# Altium project SML-230109PCB1.PrjPcb
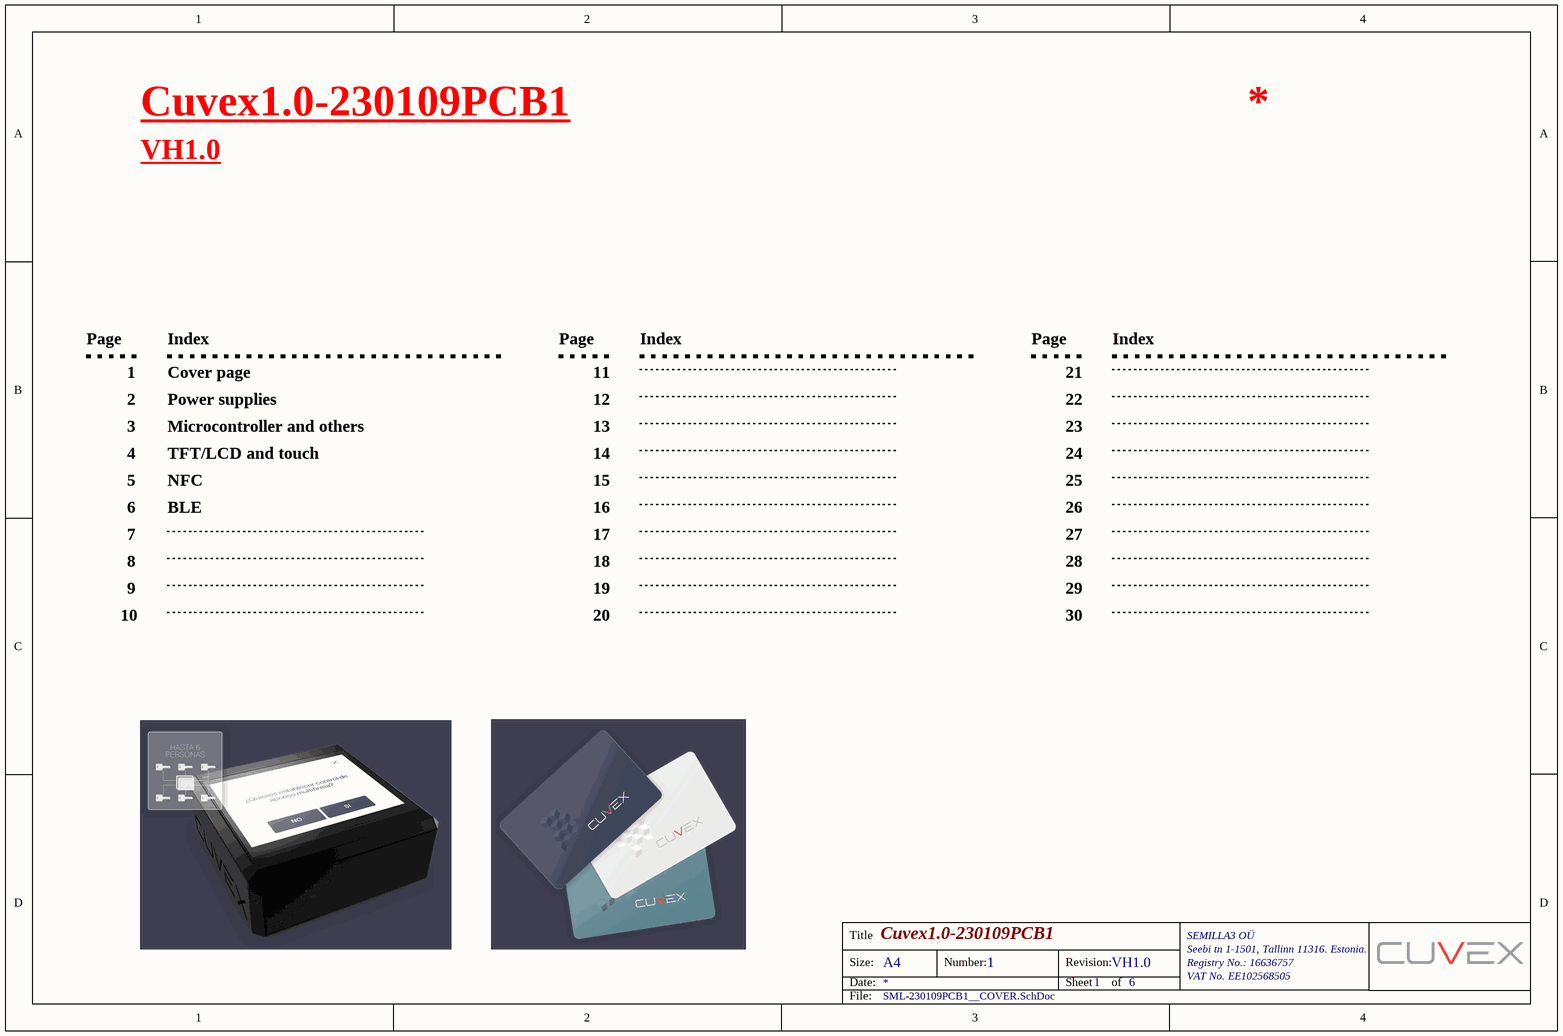
[diagram p0: SML-230109PCB1__COVER.SchDoc]
Revision: VH1.0; Title: Cuvex1.0-230109PCB1
6 sheets, 71 parts. Net scope: flat (ports and power ports of the same name join across sheets).
Board file: SML-230109PCB1.PcbDoc
Sheets:
  SML-230109PCB1__COVER.SchDoc
  SML-230109PCB1__PWR.SchDoc
  SML-230109PCB1__MCU.SchDoc
  SML-230109PCB1__LCD.SchDoc
  SML-230109PCB1__NFC.SchDoc
  SML-230109PCB1__BLE.SchDoc

## Sheet SML-230109PCB1__COVER.SchDoc: Cuvex1.0-230109PCB1
size A4; DocumentNumber: 1; SheetNumber: 1; SheetTotal: 6

### Notes on the sheet
- Page
- 1
- Index
- Cover page
- 11
- 21
- 2
- 3
- Power supplies
- Microcontroller and others
- 12
- 13
- 22
- 23
- 4
- 5
- 6
- TFT/LCD and touch
- NFC
- BLE
- 14
- 15
- 16
- 24
- 25
- 26
- 7
- 8
- 17
- 18
- 27
- 28
- 10
- 9
- 19
- 20
- 29
- 30
- Title
- Size:
- Date:
- A4
- Number:
- Revision:
- Sheet
- of
- SEMILLA3 OÜ
- Seebi tn 1-1501, Tallinn 11316. Estonia.
- Registry No.: 16636757
- VAT No. EE102568505
- File:

## Sheet SML-230109PCB1__PWR.SchDoc: Cuvex1.0-230109PCB1
size A4; DocumentNumber: 2; SheetNumber: 2; SheetTotal: 6
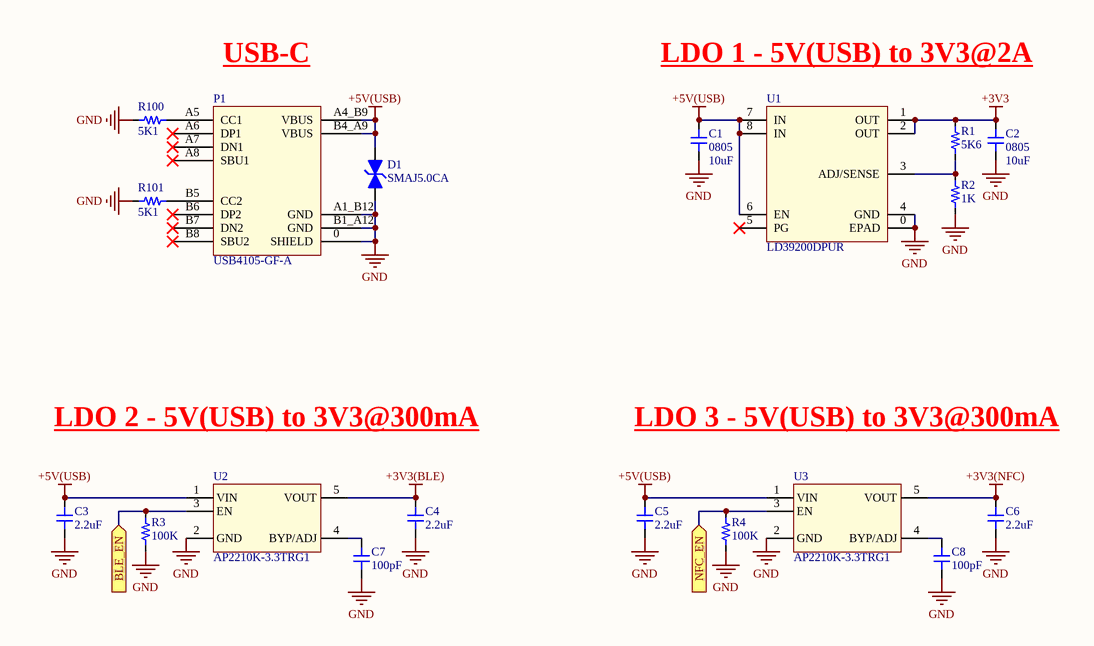
[diagram p1: SML-230109PCB1__PWR.SchDoc]

### Parts
C1  value 10uF  [06] - Package: 0805  [[G] CAP-MLCC__0805]  (hidden comment: .)
C2  value 10uF  [06] - Package: 0805  [[G] CAP-MLCC__0805]  (hidden comment: .)
C3  value 2.2uF  [[G] CAP-MLCC__0603]  (hidden comment: .)
C4  value 2.2uF  [[G] CAP-MLCC__0603]  (hidden comment: .)
C5  value 2.2uF  [[G] CAP-MLCC__0603]  (hidden comment: .)
C6  value 2.2uF  [[G] CAP-MLCC__0603]  (hidden comment: .)
C7  value 100pF  [[G] CAP-MLCC__0603]  (hidden comment: .)
C8  value 100pF  [[G] CAP-MLCC__0603]  (hidden comment: .)
D1  .  [[G] SMA(DO-214AC)__W/O]  (value not drawn)
P1  .  [CONN-USB-C__USB4105-GF-A]  (value not drawn)
R1  value 5K6  [[G] RES-CHIP__0603]  (hidden comment: .)
R2  value 1K  [[G] RES-CHIP__0603]  (hidden comment: .)
R3  value 100K  [[G] RES-CHIP__0603]  (hidden comment: .)
R4  value 100K  [[G] RES-CHIP__0603]  (hidden comment: .)
R100  value 5K1  [[G] RES-CHIP__0402]  (hidden comment: .)
R101  value 5K1  [[G] RES-CHIP__0402]  (hidden comment: .)
U1  .  [PMIC-LDO__LD39200DPUR__DFN-8(4X4)]  (value not drawn)
U2  .  [[G] SOT23-5]  (value not drawn)
U3  .  [[G] SOT23-5]  (value not drawn)

### Ports
BLE_EN (in, see 3[1A]), NFC_EN (in, see 3[1A])

### Nets
+3V3: C2.2 R1.2 U1.1(OUT) U1.2(OUT)
+3V3(BLE): C4.2 U2.5(VOUT)
+3V3(NFC): C6.2 U3.5(VOUT)
+5V(USB): C1.2 C3.2 C5.2 D1.K P1.A4_B9(VBUS) P1.B4_A9(VBUS) U1.6(EN) U1.7(IN) U1.8(IN) U2.1(VIN) U3.1(VIN)
GND: C1.1 C2.1 C3.1 C4.1 C5.1 C6.1 C7.1 C8.1 D1.A P1.0(SHIELD) P1.A1_B12(GND) P1.B1_A12(GND) R2.1 R3.1 R4.1 R100.1 R101.1 U1.0(EPAD) U1.4(GND) U2.2(GND) U3.2(GND)
BLE_EN: R3.2 U2.3(EN) ; port BLE_EN
NFC_EN: R4.2 U3.3(EN) ; port NFC_EN
NetC7_2: C7.2 U2.4(BYP/ADJ)
NetC8_2: C8.2 U3.4(BYP/ADJ)
NetP1_A5: P1.A5(CC1) R100.2
NetP1_B5: P1.B5(CC2) R101.2
NetR1_1: R1.1 R2.2 U1.3(ADJ/SENSE)

Not connected (* = marked no-connect by the designer): P1 A6(DP1)* A7(DN1)* A8(SBU1)* B6(DP2)* B7(DN2)* B8(SBU2)*; U1 5(PG)*

### Notes on the sheet
- (near P1) USB-C
- LDO 1 - 5V(USB) to 3V3@2A
- LDO 2 - 5V(USB) to 3V3@300mA
- LDO 3 - 5V(USB) to 3V3@300mA
- Title
- Size:
- Date:
- A4
- Number:
- Revision:
- Sheet
- of
- SEMILLA3 OÜ
- Seebi tn 1-1501, Tallinn 11316. Estonia.
- Registry No.: 16636757
- VAT No. EE102568505
- File:

### Library data of the parts
C1 C2 = CAP_MLCC_0805: CAP MLCC 0805; [00] - Description (BOM): CAP MLCC 10uF 0805 010; [04] - Power features: 010; STAR Code: C10uF0805010; [01] - MPN Code: *; [02] - Manufacturer: *; [03] - Datasheet: *; [05] - Temperature range: *; [07] - PVP Dealer name: *; [08] - PVP 1K: *; Voltage: 010
C3-C6 = CAP_MLCC_0603: CAP MLCC 0603; [00] - Description (BOM): CAP MLCC 2.2uF 0603 010; [04] - Power features: 010; STAR Code: C2.2uF0603010; [06] - Package: 0603; [01] - MPN Code: *; [02] - Manufacturer: *; [03] - Datasheet: *; [05] - Temperature range: *; [07] - PVP Dealer name: *; [08] - PVP 1K: *; Voltage: 010
C7 C8 = CAP_MLCC_0603: CAP MLCC 0603; [00] - Description (BOM): CAP MLCC 100pF 0603 010; [04] - Power features: 010; STAR Code: C100pF0603010; [06] - Package: 0603; [01] - MPN Code: *; [02] - Manufacturer: *; [03] - Datasheet: *; [05] - Temperature range: *; [07] - PVP Dealer name: *; [08] - PVP 1K: *; Voltage: 010
D1 = SMAJ5.0CA: DIODE TVS, SMA (DO-214AC), Vr=5V, Vbr=6'4V, Vc=9'2V, Ipp=43'5A, Pppm=400W; [02] - Manufacturer: Littelfuse; [05] - Temperature range: -65 to +150 ºC; [00] - Description (BOM): DIODE TVS, SMA (DO-214AC), Vr=5V, Vbr=6'4V, Vc=9'2V, Ipp=43'5A, Pppm=400W; [03] - Datasheet: https://www.littelfuse.com/media?resourcetype=datasheets&itemid=75e32973-b177-4ee3-a0ff-cedaf1abdb93&filename=smaj-datasheet; [04] - Power features: Vr=5V, Vbr=6'4V, Vc=9'2V, Ipp=43'5A; [06] - Package: SMA (DO-214AC); [07] - PVP Dealer name: *; [08] - PVP 1K: *; STAR Code: *; [01] - MPN Code: SMAJ5.0CA
P1 = USB4105-GF-A: CONN USB TYPE C, smd/th, right angle; [02] - Manufacturer: GCT; [04] - Power features: 20VDC, 5A (VBUS); [05] - Temperature range: -40 to +85 ºC; [00] - Description (BOM): CONN USB TYPE C, smd/th, right angle; [03] - Datasheet: https://www.mouser.es/datasheet/2/837/USB4105-2888174.pdf; [06] - Package: *; [07] - PVP Dealer name: *; [08] - PVP 1K: *; STAR Code: *; [01] - MPN Code: USB4105-GF-A
R1 = RES_SMD_0603: RES SMD 0603 [G]; [00] - Description (BOM): RES 5K6 OHM 0603 1% 1/10W; [04] - Power features: 100mW; STAR Code: 5K606031%; Tolerance: 1%; [06] - Package: 0603; [01] - MPN Code: *; [02] - Manufacturer: *; [03] - Datasheet: *; [05] - Temperature range: *; [07] - PVP Dealer name: *; [08] - PVP 1K: *
R2 = RES_SMD_0603: RES SMD 0603 [G]; [00] - Description (BOM): RES 1K OHM 0603 1% 1/10W; [04] - Power features: 100mW; STAR Code: 1K06031%; Tolerance: 1%; [06] - Package: 0603; [01] - MPN Code: *; [02] - Manufacturer: *; [03] - Datasheet: *; [05] - Temperature range: *; [07] - PVP Dealer name: *; [08] - PVP 1K: *
R3 R4 = RES_SMD_0603: RES SMD 0603 [G]; [00] - Description (BOM): RES 100K OHM 0603 1% 1/10W; [04] - Power features: 100mW; STAR Code: 100K06031%; Tolerance: 1%; [06] - Package: 0603; [01] - MPN Code: *; [02] - Manufacturer: *; [03] - Datasheet: *; [05] - Temperature range: *; [07] - PVP Dealer name: *; [08] - PVP 1K: *
R100 R101 = RES_SMD_0402: RES SMD 0402 [G]; [00] - Description (BOM): RES 5K1 OHM 0402 1% 1/16W; [04] - Power features: 62.5mW; STAR Code: 5K104021%; Tolerance: 1%; [06] - Package: 0402; [01] - MPN Code: *; [02] - Manufacturer: *; [03] - Datasheet: *; [05] - Temperature range: *; [07] - PVP Dealer name: *; [08] - PVP 1K: *
U1 = LD39200DPUR: PMIC LDO, DFN-8, Vout=ADJ, Iout=2000A, Vin=1'25-6'0V, Vdrop-max=130mV, Iq-max=1mA; [02] - Manufacturer: ST Microelectronics; [05] - Temperature range: -40 to +125 ºC; [06] - Package: DFN-8 (4x4mm); [00] - Description (BOM): PMIC LDO, DFN-8, Vout=ADJ, Iout=2000A, Vin=1'25-6'0V, Vdrop-max=130mV, Iq-max=1mA; [03] - Datasheet: https://www.mouser.es/datasheet/2/389/dm00102135-1798033.pdf; [04] - Power features: Vout=ADJ, Iout=2000A, Vin=1'25-6'0V, Vdrop-max=130mV, Iq-max=1mA; [07] - PVP Dealer name: *; [08] - PVP 1K: *; STAR Code: *; [01] - MPN Code: LD39200DPUR
U2 U3 = AP2210K-3.3TRG1: PMIC LDO, SOT23-5, Vout=3'3V, Iout=300mA, Vin=2'5-13'2V, Vdrop-max=250mV, Iq-max=4mA; [02] - Manufacturer: Diodes Incorporated; [05] - Temperature range: -40 to +125 ºC; [00] - Description (BOM): PMIC LDO, SOT23-5, Vout=3'3V, Iout=300mA, Vin=2'5-13'2V, Vdrop-max=250mV, Iq-max=4mA; [03] - Datasheet: https://www.diodes.com/assets/Datasheets/AP2210.pdf; [04] - Power features: Vout=3'3V, Iout=300mA, Vin=2'5-13'2V, Vdrop-max=250mV, Iq-max=4mA; [06] - Package: SOT23-5; [07] - PVP Dealer name: *; [08] - PVP 1K: *; STAR Code: *; [01] - MPN Code: AP2210K-3.3TRG1

## Sheet SML-230109PCB1__MCU.SchDoc: Cuvex1.0-230109PCB1
size A4; DocumentNumber: 3; SheetNumber: 3; SheetTotal: 6
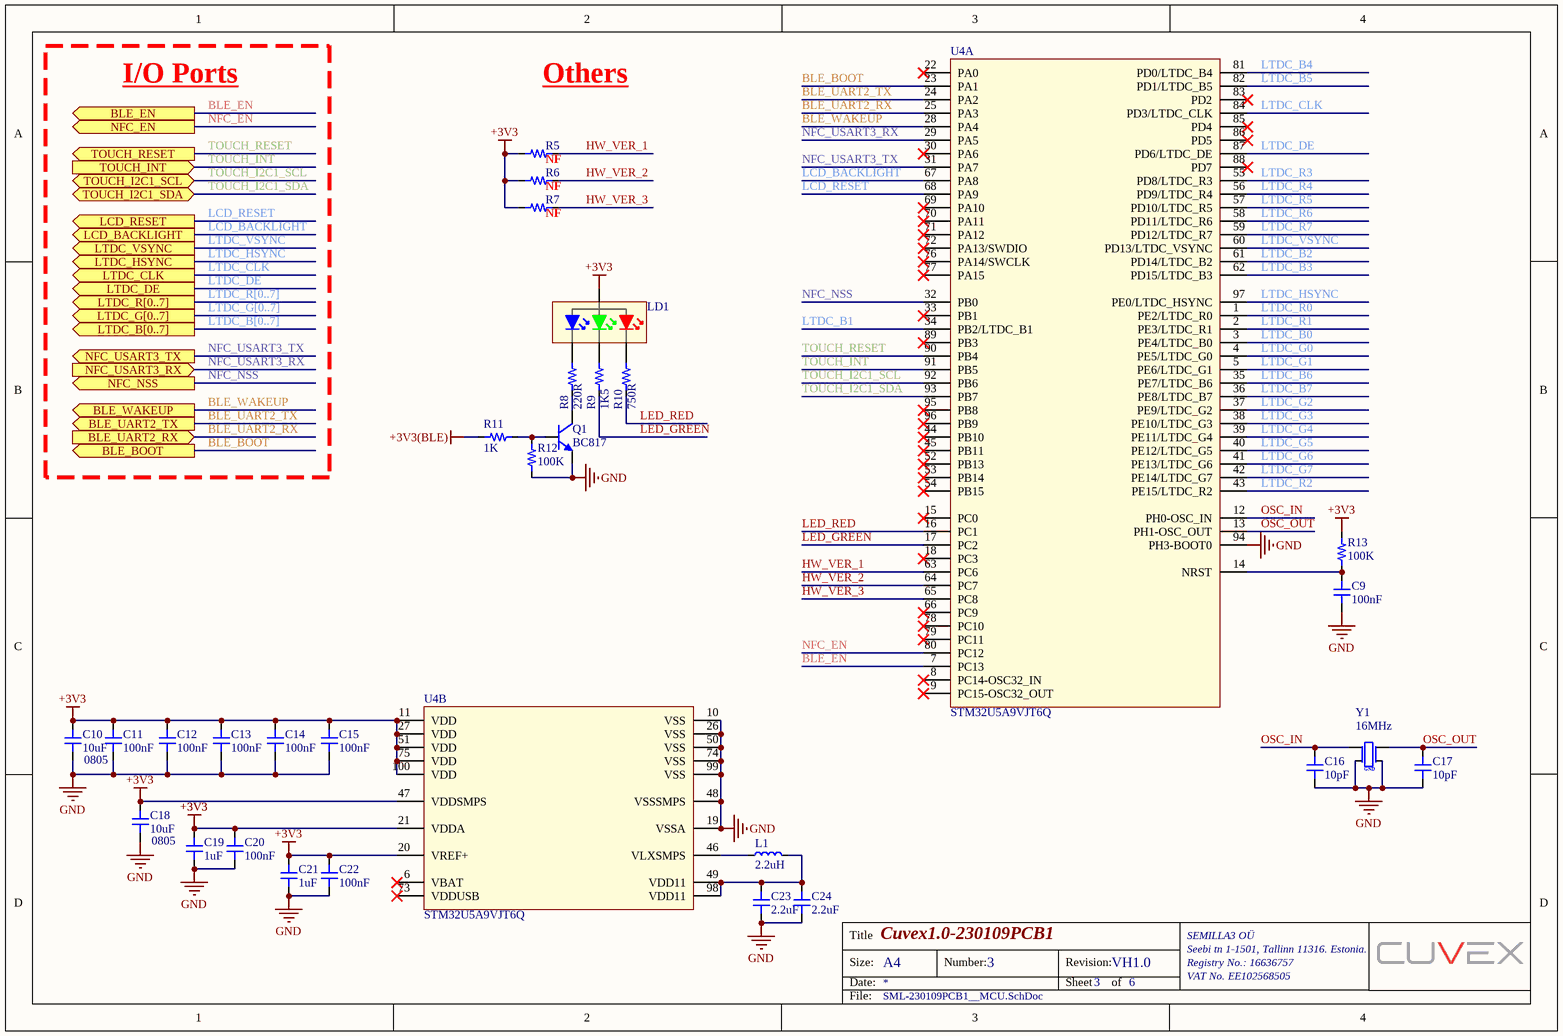
[diagram p2: SML-230109PCB1__MCU.SchDoc]

### Parts
C9  value 100nF  [[G] CAP-MLCC__0603]  (hidden comment: .)
C10  value 10uF  [06] - Package: 0805  [[G] CAP-MLCC__0805]  (hidden comment: .)
C11  value 100nF  [[G] CAP-MLCC__0603]  (hidden comment: .)
C12  value 100nF  [[G] CAP-MLCC__0603]  (hidden comment: .)
C13  value 100nF  [[G] CAP-MLCC__0603]  (hidden comment: .)
C14  value 100nF  [[G] CAP-MLCC__0603]  (hidden comment: .)
C15  value 100nF  [[G] CAP-MLCC__0603]  (hidden comment: .)
C16  value 10pF  [[G] CAP-MLCC__0603]  (hidden comment: .)
C17  value 10pF  [[G] CAP-MLCC__0603]  (hidden comment: .)
C18  value 10uF  [06] - Package: 0805  [[G] CAP-MLCC__0805]  (hidden comment: .)
C19  value 1uF  [[G] CAP-MLCC__0603]  (hidden comment: .)
C20  value 100nF  [[G] CAP-MLCC__0603]  (hidden comment: .)
C21  value 1uF  [[G] CAP-MLCC__0603]  (hidden comment: .)
C22  value 100nF  [[G] CAP-MLCC__0603]  (hidden comment: .)
C23  value 2.2uF  [[G] CAP-MLCC__0603]  (hidden comment: .)
C24  value 2.2uF  [[G] CAP-MLCC__0603]  (hidden comment: .)
L1  value 2.2uH  [[G] IND__0603]  (hidden comment: .)
LD1  .  [LED__0603-RGB__APHF1608]  (value not drawn)
Q1  .  [[G] SOT23-3]  (value not drawn)
R5  .  [[G] RES-CHIP__0603]  (value not drawn)
R6  .  [[G] RES-CHIP__0603]  (value not drawn)
R7  .  [[G] RES-CHIP__0603]  (value not drawn)
R8  value 220R  [[G] RES-CHIP__0603]  (hidden comment: .)
R9  value 1K5  [[G] RES-CHIP__0603]  (hidden comment: .)
R10  value 750R  [[G] RES-CHIP__0603]  (hidden comment: .)
R11  value 1K  [[G] RES-CHIP__0603]  (hidden comment: .)
R12  value 100K  [[G] RES-CHIP__0603]  (hidden comment: .)
R13  value 100K  [[G] RES-CHIP__0603]  (hidden comment: .)
U4  .  [[G] LQFP-100 (14X14MM)]  (value not drawn)  (parts A,B of 2)
Y1  value 16MHz  [CRYSTAL__ABM8G]  (hidden comment: .)

### Ports
BLE_BOOT (out, see 6[3C]), BLE_EN (out, see 2[1C]), BLE_UART2_RX (in, see 6[2A]), BLE_UART2_TX (out, see 6[2A]), BLE_WAKEUP (out, see 6[2A]), LCD_BACKLIGHT (out, see 4[3C]), LCD_RESET (out, see 4[1A]), LTDC_B[0..7] (out, see 4[1B]), LTDC_CLK (out, see 4[1C]), LTDC_DE (out, see 4[1D]), LTDC_G[0..7] (out, see 4[1B]), LTDC_HSYNC (out, see 4[1C]), LTDC_R[0..7] (out, see 4[1B]), LTDC_VSYNC (out, see 4[1C]), NFC_EN (out, see 2[3C]), NFC_NSS (out, see 5[2B]), NFC_USART3_RX (in, see 5[2B]), NFC_USART3_TX (out, see 5[2B]), TOUCH_I2C1_SCL (bidir, see 4[3A]), TOUCH_I2C1_SDA (bidir, see 4[3A]), TOUCH_INT (in, see 4[3B]), TOUCH_RESET (out, see 4[3A])

### Nets
+3V3: C10.2 C11.2 C12.2 C13.2 C14.2 C15.2 C18.2 C19.1 C20.1 C21.1 C22.1 LD1.A R5.1 R6.1 R7.1 R13.1 U4.11(VDD) U4.20(VREF+) U4.21(VDDA) U4.27(VDD) U4.47(VDDSMPS) U4.51(VDD) U4.75(VDD) U4.100(VDD)
+3V3(BLE): R11.2
GND: C9.2 C10.1 C11.1 C12.1 C13.1 C14.1 C15.1 C16.1 C17.1 C18.1 C19.2 C20.2 C21.2 C22.2 C23.1 C24.1 Q1.2(E) R12.1 U4.10(VSS) U4.19(VSSA) U4.26(VSS) U4.48(VSSSMPS) U4.50(VSS) U4.74(VSS) U4.94(PH3-BOOT0) U4.99(VSS) Y1.2(gnd) Y1.4(gnd)
BLE_BOOT: U4.23(PA1) ; port BLE_BOOT
BLE_EN: U4.7(PC13) ; port BLE_EN
BLE_UART2_RX: U4.25(PA3) ; port BLE_UART2_RX
BLE_UART2_TX: U4.24(PA2) ; port BLE_UART2_TX
BLE_WAKEUP: U4.28(PA4) ; port BLE_WAKEUP
HW_VER_1: R5.2 U4.63(PC6)
HW_VER_2: R6.2 U4.64(PC7)
HW_VER_3: R7.2 U4.65(PC8)
LCD_BACKLIGHT: U4.67(PA8) ; port LCD_BACKLIGHT
LCD_RESET: U4.68(PA9) ; port LCD_RESET
LED_GREEN: R9.2 U4.17(PC2)
LED_RED: R10.2 U4.16(PC1)
LTDC_B0: U4.3(PE4/LTDC_B0)
LTDC_B1: U4.34(PB2/LTDC_B1)
LTDC_B2: U4.61(PD14/LTDC_B2)
LTDC_B3: U4.62(PD15/LTDC_B3)
LTDC_B4: U4.81(PD0/LTDC_B4)
LTDC_B5: U4.82(PD1/LTDC_B5)
LTDC_B6: U4.35(PE7/LTDC_B6)
LTDC_B7: U4.36(PE8/LTDC_B7)
LTDC_CLK: U4.84(PD3/LTDC_CLK) ; port LTDC_CLK
LTDC_DE: U4.87(PD6/LTDC_DE) ; port LTDC_DE
LTDC_G0: U4.4(PE5/LTDC_G0)
LTDC_G1: U4.5(PE6/LTDC_G1)
LTDC_G2: U4.37(PE9/LTDC_G2)
LTDC_G3: U4.38(PE10/LTDC_G3)
LTDC_G4: U4.39(PE11/LTDC_G4)
LTDC_G5: U4.40(PE12/LTDC_G5)
LTDC_G6: U4.41(PE13/LTDC_G6)
LTDC_G7: U4.42(PE14/LTDC_G7)
LTDC_HSYNC: U4.97(PE0/LTDC_HSYNC) ; port LTDC_HSYNC
LTDC_R0: U4.1(PE2/LTDC_R0)
LTDC_R1: U4.2(PE3/LTDC_R1)
LTDC_R2: U4.43(PE15/LTDC_R2)
LTDC_R3: U4.55(PD8/LTDC_R3)
LTDC_R4: U4.56(PD9/LTDC_R4)
LTDC_R5: U4.57(PD10/LTDC_R5)
LTDC_R6: U4.58(PD11/LTDC_R6)
LTDC_R7: U4.59(PD12/LTDC_R7)
LTDC_VSYNC: U4.60(PD13/LTDC_VSYNC) ; port LTDC_VSYNC
NFC_EN: U4.80(PC12) ; port NFC_EN
NFC_NSS: U4.32(PB0) ; port NFC_NSS
NFC_USART3_RX: U4.29(PA5) ; port NFC_USART3_RX
NFC_USART3_TX: U4.31(PA7) ; port NFC_USART3_TX
OSC_IN: C16.2 U4.12(PH0-OSC_IN) Y1.1(OSC1)
OSC_OUT: C17.2 U4.13(PH1-OSC_OUT) Y1.3(OSC2)
TOUCH_I2C1_SCL: U4.92(PB6) ; port TOUCH_I2C1_SCL
TOUCH_I2C1_SDA: U4.93(PB7) ; port TOUCH_I2C1_SDA
TOUCH_INT: U4.91(PB5) ; port TOUCH_INT
TOUCH_RESET: U4.90(PB4) ; port TOUCH_RESET
NetC9_1: C9.1 R13.2 U4.14(NRST)
NetC23_2: C23.2 C24.2 L1.2 U4.49(VDD11) U4.98(VDD11)
NetL1_1: L1.1 U4.46(VLXSMPS)
NetLD1_KB: LD1.KB R8.2
NetLD1_KG: LD1.KG R9.1
NetLD1_KR: LD1.KR R10.1
NetQ1_1: Q1.1(B) R11.1 R12.2
NetQ1_3: Q1.3(C) R8.1

Not connected (* = marked no-connect by the designer): U4 6(VBAT)* 8(PC14-OSC32_IN)* 9(PC15-OSC32_OUT)* 15(PC0)* 18(PC3)* 22(PA0)* 30(PA6)* 33(PB1)* 44(PB10)* 45(PB11)* 52(PB13)* 53(PB14)* 54(PB15)* 66(PC9)* 69(PA10)* 70(PA11)* 71(PA12)* 72(PA13/SWDIO)* 73(VDDUSB)* 76(PA14/SWCLK)* 77(PA15)* 78(PC10)* 79(PC11)* 83(PD2)* 85(PD4)* 86(PD5)* 88(PD7)* 89(PB3)* 95(PB8)* 96(PB9)*

### Buses and harness runs
bus LTDC_B[0..7] = port LTDC_B[0..7]
bus LTDC_G[0..7] = port LTDC_G[0..7]
bus LTDC_R[0..7] = port LTDC_R[0..7]

### Notes on the sheet
- I/O Ports
- Others
- (near R5) NF
- (near R6) NF
- (near R7) NF
- Title
- Size:
- Date:
- A4
- Number:
- Revision:
- Sheet
- of
- SEMILLA3 OÜ
- Seebi tn 1-1501, Tallinn 11316. Estonia.
- Registry No.: 16636757
- VAT No. EE102568505
- File:
- (in symbol ABM8G-16.000MHZ-4Y-T3) GND

### Library data of the parts
C9 C11-C15 C20 C22 = CAP_MLCC_0603: CAP MLCC 0603; [00] - Description (BOM): CAP MLCC 100nF 0603 010; [04] - Power features: 010; STAR Code: C100nF0603010; [06] - Package: 0603; [01] - MPN Code: *; [02] - Manufacturer: *; [03] - Datasheet: *; [05] - Temperature range: *; [07] - PVP Dealer name: *; [08] - PVP 1K: *; Voltage: 010
C10 C18 = CAP_MLCC_0805: as C1 on sheet SML-230109PCB1__PWR; [01] - MPN Code: *; [02] - Manufacturer: *; [03] - Datasheet: *; [05] - Temperature range: *; [07] - PVP Dealer name: *; [08] - PVP 1K: *; Voltage: 010
C16 C17 = CAP_MLCC_0603: CAP MLCC 0603; [00] - Description (BOM): CAP MLCC 10pF 0603 010; [04] - Power features: 010; STAR Code: C10pF0603010; [06] - Package: 0603; [01] - MPN Code: *; [02] - Manufacturer: *; [03] - Datasheet: *; [05] - Temperature range: *; [07] - PVP Dealer name: *; [08] - PVP 1K: *; Voltage: 010
C19 C21 = CAP_MLCC_0603: CAP MLCC 0603; [00] - Description (BOM): CAP MLCC 1uF 0603 010; [04] - Power features: 010; STAR Code: C1uF0603010; [06] - Package: 0603; [01] - MPN Code: *; [02] - Manufacturer: *; [03] - Datasheet: *; [05] - Temperature range: *; [07] - PVP Dealer name: *; [08] - PVP 1K: *; Voltage: 010
C23 C24 = CAP_MLCC_0603: as C3 on sheet SML-230109PCB1__PWR; [01] - MPN Code: *; [02] - Manufacturer: *; [03] - Datasheet: *; [05] - Temperature range: *; [07] - PVP Dealer name: *; [08] - PVP 1K: *; Voltage: 010
L1 = IND_SMD_0603: IND SMD 0603 [G]; [01] - MPN Code: LQM18FN2R2M00D; [00] - Description (BOM): IND 2.2uH 0603; [06] - Package: 0603; [02] - Manufacturer: *; [03] - Datasheet: *; [04] - Power features: *; [05] - Temperature range: *; [07] - PVP Dealer name: *; [08] - PVP 1K: *; STAR Code: *
LD1 = APHF1608LSEEQBDZGKC: LED 0603, RGB (621/525/465nm), If=2mA, Vf=1'8-2'65V; [02] - Manufacturer: Kingbright; [05] - Temperature range: -40 to+85 ºC; [06] - Package: 0603; [00] - Description (BOM): LED 0603, RGB (621/525/465nm), If=2mA, Vf=1'8-2'65V; [03] - Datasheet: https://www.mouser.es/datasheet/2/216/APHF1608LSEEQBDZGKC-1145215.pdf; [04] - Power features: If=2mA, Vf=1'8-2'65V; [07] - PVP Dealer name: *; [08] - PVP 1K: *; STAR Code: *; [01] - MPN Code: APHF1608LSEEQBDZGKC
Q1 = BC817: TRANS BIPOLAR NPN, SOT23-3 [G]; [00] - Description (BOM): TRANS BIPOLAR NPN, SOT23-3 [G]; [02] - Manufacturer: *; [03] - Datasheet: *; [04] - Power features: *; [05] - Temperature range: *; [06] - Package: SOT23-3; [07] - PVP Dealer name: *; [08] - PVP 1K: *; [01] - MPN Code: *; STAR Code: BC817
R5-R7 = RES_SMD_0603: RES SMD 0603 [G]; [00] - Description (BOM): RES * OHM 0603 1% 1/10W; [04] - Power features: 100mW; STAR Code: *06031%; Tolerance: 1%; [06] - Package: 0603; [01] - MPN Code: *; [02] - Manufacturer: *; [03] - Datasheet: *; [05] - Temperature range: *; [07] - PVP Dealer name: *; [08] - PVP 1K: *; Value: *
R8 = RES_SMD_0603: RES SMD 0603 [G]; [00] - Description (BOM): RES 220R OHM 0603 1% 1/10W; [04] - Power features: 100mW; STAR Code: 220R06031%; Tolerance: 1%; [06] - Package: 0603; [01] - MPN Code: *; [02] - Manufacturer: *; [03] - Datasheet: *; [05] - Temperature range: *; [07] - PVP Dealer name: *; [08] - PVP 1K: *
R9 = RES_SMD_0603: RES SMD 0603 [G]; [00] - Description (BOM): RES 1K5 OHM 0603 1% 1/10W; [04] - Power features: 100mW; STAR Code: 1K506031%; Tolerance: 1%; [06] - Package: 0603; [01] - MPN Code: *; [02] - Manufacturer: *; [03] - Datasheet: *; [05] - Temperature range: *; [07] - PVP Dealer name: *; [08] - PVP 1K: *
R10 = RES_SMD_0603: RES SMD 0603 [G]; [00] - Description (BOM): RES 750R OHM 0603 1% 1/10W; [04] - Power features: 100mW; STAR Code: 750R06031%; Tolerance: 1%; [06] - Package: 0603; [01] - MPN Code: *; [02] - Manufacturer: *; [03] - Datasheet: *; [05] - Temperature range: *; [07] - PVP Dealer name: *; [08] - PVP 1K: *
R11 = RES_SMD_0603: as R2 on sheet SML-230109PCB1__PWR; [01] - MPN Code: *; [02] - Manufacturer: *; [03] - Datasheet: *; [05] - Temperature range: *; [07] - PVP Dealer name: *; [08] - PVP 1K: *
R12 R13 = RES_SMD_0603: as R3 on sheet SML-230109PCB1__PWR; [01] - MPN Code: *; [02] - Manufacturer: *; [03] - Datasheet: *; [05] - Temperature range: *; [07] - PVP Dealer name: *; [08] - PVP 1K: *
U4 = STM32U5A9VJT6Q: MCU ARM 32bit, Cortex-M33 (160MHz), 4MB/2'5MB, LQFP-100 (14x14), SMPS, TrustZone, LTDC, crypto; [02] - Manufacturer: STMicroelectronics; [04] - Power features: Vin=1'71-3'6V; [05] - Temperature range: -40 to +85 ºC; [00] - Description (BOM): MCU ARM 32bit, Cortex-M33 (160MHz), 4MB/2'5MB, LQFP-100 (14x14), SMPS, TrustZone, LTDC, crypto; [03] - Datasheet: https://www.st.com/resource/en/datasheet/stm32u5a9vj.pdf; [06] - Package: LQFP-100 (14x14); [07] - PVP Dealer name: *; [08] - PVP 1K: *; STAR Code: *; [01] - MPN Code: STM32U5A9VJT6Q
Y1 = ABM8G-16.000MHZ-4Y-T3: CRYSTAL, 16.0000MHz, ±30ppm, CL=10pF, CS=5pF; [02] - Manufacturer: Abracon LLC; [05] - Temperature range: -10 to +60 ºC; [06] - Package: ABM8G (3.2 x 2.5mm); [00] - Description (BOM): CRYSTAL, 16.0000MHz, ±30ppm, CL=10pF, CS=5pF; [03] - Datasheet: https://www.mouser.es/datasheet/2/3/ABM8G-1608872.pdf; [04] - Power features: *; [07] - PVP Dealer name: *; [08] - PVP 1K: *; STAR Code: *; [01] - MPN Code: ABM8G-16.000MHZ-4Y-T3

## Sheet SML-230109PCB1__LCD.SchDoc: Cuvex1.0-230109PCB1
size A4; DocumentNumber: 4; SheetNumber: 4; SheetTotal: 6
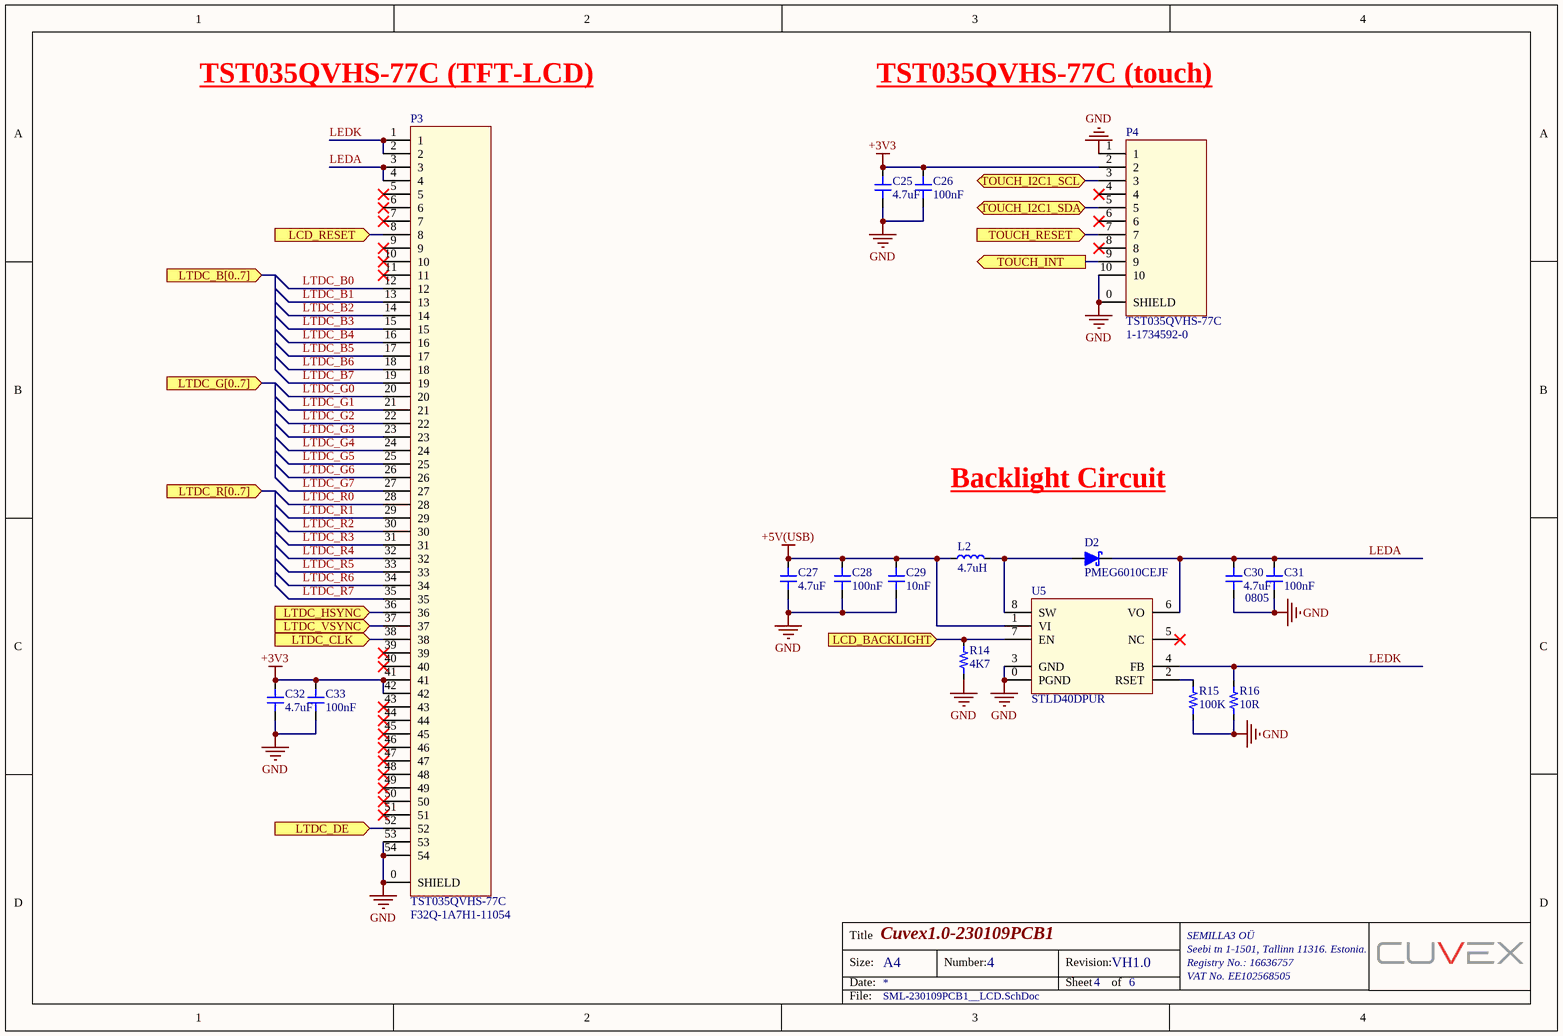
[diagram p3: SML-230109PCB1__LCD.SchDoc]

### Parts
C25  value 4.7uF  [[G] CAP-MLCC__0603]  (hidden comment: .)
C26  value 100nF  [[G] CAP-MLCC__0603]  (hidden comment: .)
C27  value 4.7uF  [[G] CAP-MLCC__0603]  (hidden comment: .)
C28  value 100nF  [[G] CAP-MLCC__0603]  (hidden comment: .)
C29  value 10nF  [[G] CAP-MLCC__0603]  (hidden comment: .)
C30  value 4.7uF  [06] - Package: 0805  [[G] CAP-MLCC__0805]  (hidden comment: .)
C31  value 100nF  [[G] CAP-MLCC__0603]  (hidden comment: .)
C32  value 4.7uF  [[G] CAP-MLCC__0603]  (hidden comment: .)
C33  value 100nF  [[G] CAP-MLCC__0603]  (hidden comment: .)
D2  .  [[G] SOD-323__W]  (value not drawn)
L2  value 4.7uH  [IND__LQH32PH__3'2x2'5x1'55mm]  (hidden comment: .)
P3  TFT-LCD: TST035QVHS-77C  [CONN-FFC/FPC__AMPHENOL__54P-TOP__F32Q-1A7H1-11054__INV]  (hidden comment: .)
P4  TFT-LCD: TST035QVHS-77C  [CONN-FFC/FPC__TE__10P-BOT__1-1734592-0__INV]  (hidden comment: .)
R14  value 4K7  [[G] RES-CHIP__0603]  (hidden comment: .)
R15  value 100K  [[G] RES-CHIP__0603]  (hidden comment: .)
R16  value 10R  [[G] RES-CHIP__0603]  (hidden comment: .)
U5  .  [IC-DRV-LED__STLD40DPUR__QFN-8(3X3)]  (value not drawn)

### Ports
LCD_BACKLIGHT (in, see 3[1A]), LCD_RESET (in, see 3[1A]), LTDC_B[0..7] (in, see 3[1B]), LTDC_CLK (in, see 3[1B]), LTDC_DE (in, see 3[1B]), LTDC_G[0..7] (in, see 3[1B]), LTDC_HSYNC (in, see 3[1B]), LTDC_R[0..7] (in, see 3[1B]), LTDC_VSYNC (in, see 3[1A]), TOUCH_I2C1_SCL (bidir, see 3[1A]), TOUCH_I2C1_SDA (bidir, see 3[1A]), TOUCH_INT (out, see 3[1A]), TOUCH_RESET (in, see 3[1A])

### Nets
+3V3: C25.2 C26.2 C32.2 C33.2 P3.41 P3.42 P4.2
+5V(USB): C27.2 C28.2 C29.2 L2.1 U5.1(VI)
GND: C25.1 C26.1 C27.1 C28.1 C29.1 C30.1 C31.1 C32.1 C33.1 P3.0(SHIELD) P3.53 P3.54 P4.0(SHIELD) P4.1 P4.10 R14.2 R15.1 R16.1 U5.0(PGND) U5.3(GND)
LCD_BACKLIGHT: R14.1 U5.7(EN) ; port LCD_BACKLIGHT
LCD_RESET: P3.8 ; port LCD_RESET
LEDA: C30.2 C31.2 D2.K P3.3 P3.4 U5.6(VO)
LEDK: P3.1 P3.2 R16.2 U5.4(FB)
LTDC_B0: P3.12
LTDC_B1: P3.13
LTDC_B2: P3.14
LTDC_B3: P3.15
LTDC_B4: P3.16
LTDC_B5: P3.17
LTDC_B6: P3.18
LTDC_B7: P3.19
LTDC_CLK: P3.38 ; port LTDC_CLK
LTDC_DE: P3.52 ; port LTDC_DE
LTDC_G0: P3.20
LTDC_G1: P3.21
LTDC_G2: P3.22
LTDC_G3: P3.23
LTDC_G4: P3.24
LTDC_G5: P3.25
LTDC_G6: P3.26
LTDC_G7: P3.27
LTDC_HSYNC: P3.36 ; port LTDC_HSYNC
LTDC_R0: P3.28
LTDC_R1: P3.29
LTDC_R2: P3.30
LTDC_R3: P3.31
LTDC_R4: P3.32
LTDC_R5: P3.33
LTDC_R6: P3.34
LTDC_R7: P3.35
LTDC_VSYNC: P3.37 ; port LTDC_VSYNC
TOUCH_I2C1_SCL: P4.3 ; port TOUCH_I2C1_SCL
TOUCH_I2C1_SDA: P4.5 ; port TOUCH_I2C1_SDA
TOUCH_INT: P4.9 ; port TOUCH_INT
TOUCH_RESET: P4.7 ; port TOUCH_RESET
NetD2_A: D2.A L2.2 U5.8(SW)
NetR15_2: R15.2 U5.2(RSET)

Not connected (* = marked no-connect by the designer): P3 5* 6* 7* 9* 10* 11* 39* 40* 43* 44* 45* 46* 47* 48* 49* 50* 51*; P4 4* 6* 8*; U5 5(NC)*

### Notes on the sheet
- (near P3) TST035QVHS-77C (TFT-LCD)
- TST035QVHS-77C (touch)
- Backlight Circuit
- Title
- Size:
- Date:
- A4
- Number:
- Revision:
- Sheet
- of
- SEMILLA3 OÜ
- Seebi tn 1-1501, Tallinn 11316. Estonia.
- Registry No.: 16636757
- VAT No. EE102568505
- File:

### Library data of the parts
C25 C27 C32 = CAP_MLCC_0603: CAP MLCC 0603; [00] - Description (BOM): CAP MLCC 4.7uF 0603 010; [04] - Power features: 010; STAR Code: C4.7uF0603010; [06] - Package: 0603; [01] - MPN Code: *; [02] - Manufacturer: *; [03] - Datasheet: *; [05] - Temperature range: *; [07] - PVP Dealer name: *; [08] - PVP 1K: *; Voltage: 010
C26 C28 C33 = CAP_MLCC_0603: as C9 on sheet SML-230109PCB1__MCU; [01] - MPN Code: *; [02] - Manufacturer: *; [03] - Datasheet: *; [05] - Temperature range: *; [07] - PVP Dealer name: *; [08] - PVP 1K: *; Voltage: 010
C29 = CAP_MLCC_0603: CAP MLCC 0603; [00] - Description (BOM): CAP MLCC 10nF 0603 010; [04] - Power features: 010; STAR Code: C10nF0603010; [06] - Package: 0603; [01] - MPN Code: *; [02] - Manufacturer: *; [03] - Datasheet: *; [05] - Temperature range: *; [07] - PVP Dealer name: *; [08] - PVP 1K: *; Voltage: 010
C30 = CAP_MLCC_0805: CAP MLCC 0805; [00] - Description (BOM): CAP MLCC 4.7uF 0805 050; [04] - Power features: 050; STAR Code: C4.7uF0805050; [01] - MPN Code: *; [02] - Manufacturer: *; [03] - Datasheet: *; [05] - Temperature range: *; [07] - PVP Dealer name: *; [08] - PVP 1K: *; Voltage: 050
C31 = CAP_MLCC_0603: CAP MLCC 0603; [00] - Description (BOM): CAP MLCC 100nF 0603 050; [04] - Power features: 050; STAR Code: C100nF0603050; [06] - Package: 0603; [01] - MPN Code: *; [02] - Manufacturer: *; [03] - Datasheet: *; [05] - Temperature range: *; [07] - PVP Dealer name: *; [08] - PVP 1K: *; Voltage: 050
D2 = PMEG6010CEJF: DIODE SCHOTTKY & RECTIFIER, SOD-323F, Vf=570mV, If=1A, Vr=60V, Ir=50uA; [02] - Manufacturer: Nexperia; [05] - Temperature range: -65 to +150 ºC; [00] - Description (BOM): DIODE SCHOTTKY & RECTIFIER, SOD-323F, Vf=570mV, If=1A, Vr=60V, Ir=50uA; [03] - Datasheet: https://www.mouser.es/datasheet/2/916/PMEG6010CEH_PMEG6010CEJ-1319617.pdf; [04] - Power features: Vf=570mV, If=1A, Vr=60V, Ir=50uA; [06] - Package: SOD-323F; [07] - PVP Dealer name: *; [08] - PVP 1K: *; STAR Code: *; [01] - MPN Code: PMEG6010CEJF
L2 = LQH32PH4R7NN0L: IND Murata, LQH32PHxxx, 4'7uH; [04] - Power features: Iccmáx=1A, Rccmáx=180mohm, 30%; [05] - Temperature range: -40 to +125 ºC; [06] - Package: LQH32PHxxx (3.2x2.5mm); [00] - Description (BOM): IND Murata, LQH32PHxxx, 4'7uH; [02] - Manufacturer: Murata; [03] - Datasheet: https://www.mouser.mx/datasheet/2/281/1/JELF243A_9136-1699509.pdf; [07] - PVP Dealer name: *; [08] - PVP 1K: *; STAR Code: *; [01] - MPN Code: LQH32PH4R7NN0L
P3 = F32Q-1A7H1-11054: CONN FFC/FPC, AMPHENOL, right angle, 54pin (0'5mm), top contact; [04] - Power features: V=50Vac/dc, I=±500mA; [05] - Temperature range: -40 to +105 ºC; [06] - Package: 34'3 x 5'5 x 2 mm; [00] - Description (BOM): CONN FFC/FPC, AMPHENOL, right angle, 54pin (0'5mm), top contact; [02] - Manufacturer: Amphenol; [03] - Datasheet: https://cdn.amphenol-cs.com/media/wysiwyg/files/documentation/datasheet/flex/ffc_fpc_050mm_f32r_f32q.pdf; [07] - PVP Dealer name: *; [08] - PVP 1K: *; STAR Code: *; [01] - MPN Code: F32Q-1A7H1-11054
P4 = 1-1734592-0: CONN FFC/FPC, TE, right angle, 10pin (0'5mm), bot contact; [02] - Manufacturer: TE Connectivity; [04] - Power features: V=250Vac/dc, I=500mA; [05] - Temperature range: -40 to +85 ºC; [06] - Package: 10'43 x 5'1 x 2 mm; [00] - Description (BOM): CONN FFC/FPC, TE, right angle, 10pin (0'5mm), bot contact; [03] - Datasheet: https://www.te.com/commerce/DocumentDelivery/DDEController?Action=showdoc&DocId=Customer+Drawing%7F1734839%7FC%7Fpdf%7FEnglish%7FENG_CD_1734839_C_C_1734839.pdf%7F1-1734839-0; [07] - PVP Dealer name: *; [08] - PVP 1K: *; STAR Code: *; [01] - MPN Code: 1-1734592-0
R14 = RES_SMD_0603: RES SMD 0603 [G]; [00] - Description (BOM): RES 4K7 OHM 0603 1% 1/10W; [04] - Power features: 100mW; STAR Code: 4K706031%; Tolerance: 1%; [06] - Package: 0603; [01] - MPN Code: *; [02] - Manufacturer: *; [03] - Datasheet: *; [05] - Temperature range: *; [07] - PVP Dealer name: *; [08] - PVP 1K: *
R15 = RES_SMD_0603: as R3 on sheet SML-230109PCB1__PWR; [01] - MPN Code: *; [02] - Manufacturer: *; [03] - Datasheet: *; [05] - Temperature range: *; [07] - PVP Dealer name: *; [08] - PVP 1K: *
R16 = RES_SMD_0603: RES SMD 0603 [G]; [00] - Description (BOM): RES 10R OHM 0603 1% 1/10W; [04] - Power features: 100mW; STAR Code: 10R06031%; Tolerance: 1%; [06] - Package: 0603; [01] - MPN Code: *; [02] - Manufacturer: *; [03] - Datasheet: *; [05] - Temperature range: *; [07] - PVP Dealer name: *; [08] - PVP 1K: *
U5 = STLD40DPUR: IC DRV LED BOOST, 1 output, Vdd=3'00-5'5V, Vout≤37V, Iout=20mA; [02] - Manufacturer: ST Microelectronics; [05] - Temperature range: -40 to +85 ºC; [06] - Package: QFN-8(3x3); [00] - Description (BOM): IC DRV LED BOOST, 1 output, Vdd=3'00-5'5V, Vout≤37V, Iout=20mA; [03] - Datasheet: https://www.mouser.es/datasheet/2/389/stld40d-1850966.pdf; [04] - Power features: Vdd=3'00-5'5V, Vout≤37V, Iout=20mA; [07] - PVP Dealer name: *; [08] - PVP 1K: *; STAR Code: *; [01] - MPN Code: STLD40DPUR

## Sheet SML-230109PCB1__NFC.SchDoc: Cuvex1.0-230109PCB1
size A4; DocumentNumber: 5; SheetNumber: 5; SheetTotal: 6
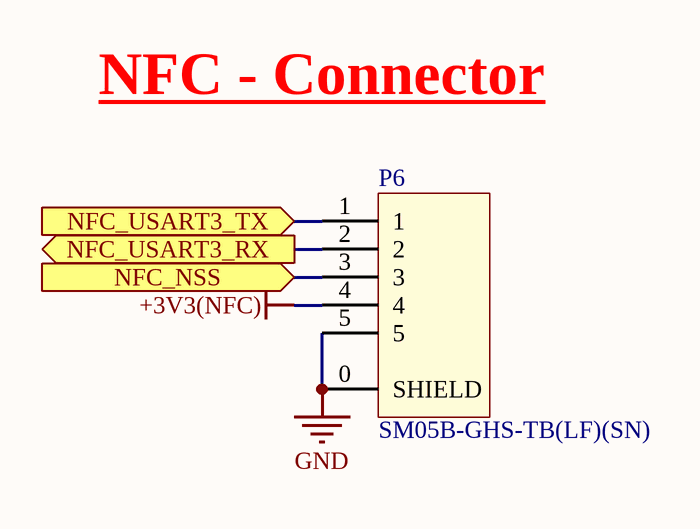
[diagram p4: SML-230109PCB1__NFC.SchDoc]

### Parts
P6  .  [CONN-SMD__JST(5PIN)__SM05B-GHS-TB(LF)(SN)]  (value not drawn)

### Ports
NFC_NSS (in, see 3[1B]), NFC_USART3_RX (out, see 3[1B]), NFC_USART3_TX (in, see 3[1B])

### Nets
+3V3(NFC): P6.4
GND: P6.0(SHIELD) P6.5
NFC_NSS: P6.3 ; port NFC_NSS
NFC_USART3_RX: P6.2 ; port NFC_USART3_RX
NFC_USART3_TX: P6.1 ; port NFC_USART3_TX

### Notes on the sheet
- NFC - Connector
- Title
- Size:
- Date:
- A4
- Number:
- Revision:
- Sheet
- of
- SEMILLA3 OÜ
- Seebi tn 1-1501, Tallinn 11316. Estonia.
- Registry No.: 16636757
- VAT No. EE102568505
- File:

### Library data of the parts
P6 = SM05B-GHS-TB(LF)(SN): CONN SMD, JST, side entry, 1x5pin, with lock, 1A, 50V; [04] - Power features: 1A (AC/DC), 50V (AC/DC); [05] - Temperature range: -25 to +85 ºC; [06] - Package: 1x5pin, pitch=1'25mm; Matching connector: GHR-05V-S; [00] - Description (BOM): CONN SMD, JST, side entry, 1x5pin, with lock, 1A, 50V; [02] - Manufacturer: JST; [03] - Datasheet: https://www.jst-mfg.com/product/pdf/eng/eGH.pdf; [07] - PVP Dealer name: *; [08] - PVP 1K: *; STAR Code: *; [01] - MPN Code: SM05B-GHS-TB(LF)(SN)

## Sheet SML-230109PCB1__BLE.SchDoc: Cuvex1.0-230109PCB1
size A4; DocumentNumber: 6; SheetNumber: 6; SheetTotal: 6
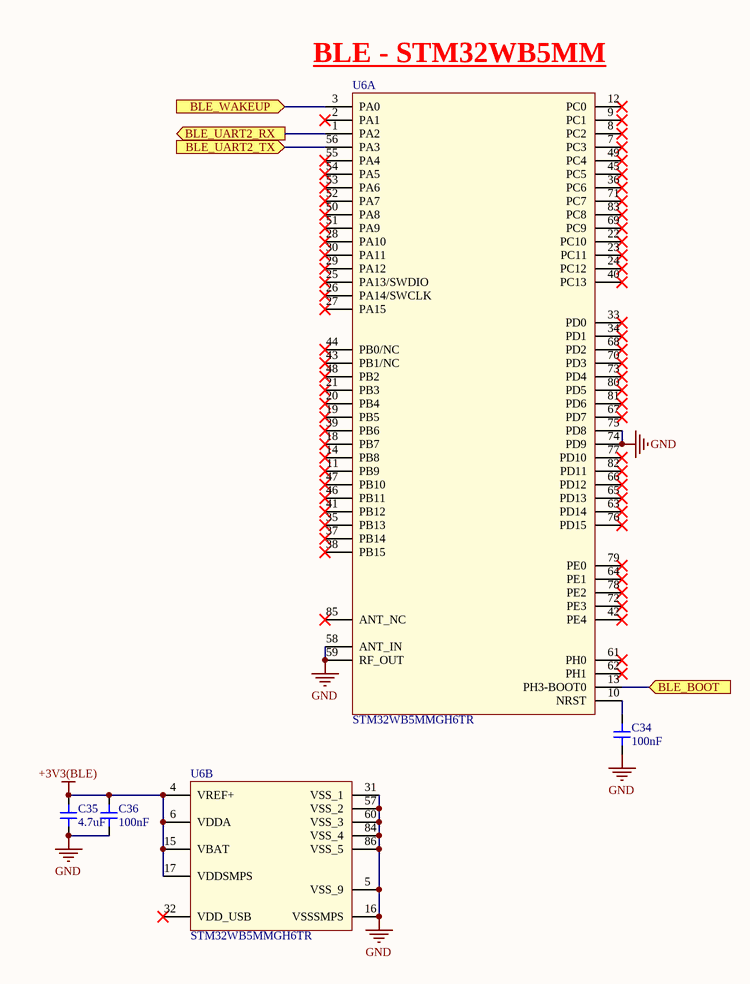
[diagram p5: SML-230109PCB1__BLE.SchDoc]

### Parts
C34  value 100nF  [[G] CAP-MLCC__0603]  (hidden comment: .)
C35  value 4.7uF  [[G] CAP-MLCC__0603]  (hidden comment: .)
C36  value 100nF  [[G] CAP-MLCC__0603]  (hidden comment: .)
U6  .  [MCU/BLE__STM32WB5MMG__SIP-LGA-86]  (value not drawn)  (parts A,B of 2)

### Ports
BLE_BOOT (in, see 3[1B]), BLE_UART2_RX (out, see 3[1B]), BLE_UART2_TX (in, see 3[1B]), BLE_WAKEUP (in, see 3[1B])

### Nets
+3V3(BLE): C35.2 C36.2 U6.4(VREF+) U6.6(VDDA) U6.15(VBAT) U6.17(VDDSMPS)
GND: C34.1 C35.1 C36.1 U6.5(VSS_9) U6.16(VSSSMPS) U6.31(VSS_1) U6.57(VSS_2) U6.58(ANT_IN) U6.59(RF_OUT) U6.60(VSS_3) U6.74(PD9) U6.75(PD8) U6.84(VSS_4) U6.86(VSS_5)
BLE_BOOT: U6.13(PH3-BOOT0) ; port BLE_BOOT
BLE_UART2_RX: U6.1(PA2) ; port BLE_UART2_RX
BLE_UART2_TX: U6.56(PA3) ; port BLE_UART2_TX
BLE_WAKEUP: U6.3(PA0) ; port BLE_WAKEUP
NetC34_2: C34.2 U6.10(NRST)

Not connected (* = marked no-connect by the designer): U6 2(PA1)* 7(PC3)* 8(PC2)* 9(PC1)* 11(PB9)* 12(PC0)* 14(PB8)* 18(PB7)* 19(PB5)* 20(PB4)* 21(PB3)* 22(PC10)* 23(PC11)* 24(PC12)* 25(PA13/SWDIO)* 26(PA14/SWCLK)* 27(PA15)* 28(PA10)* 29(PA12)* 30(PA11)* 32(VDD_USB)* 33(PD0)* 34(PD1)* 35(PB13)* 36(PC6)* 37(PB14)* 38(PB15)* 39(PB6)* 40(PC13)* 41(PB12)* 42(PE4)* 43(PB1/NC)* 44(PB0/NC)* 45(PC5)* 46(PB11)* 47(PB10)* 48(PB2)* 49(PC4)* 50(PA8)* 51(PA9)* 52(PA7)* 53(PA6)* 54(PA5)* 55(PA4)* 61(PH0)* 62(PH1)* 63(PD14)* 64(PE1)* 65(PD13)* 66(PD12)* 67(PD7)* 68(PD2)* 69(PC9)* 70(PD3)* 71(PC7)* 72(PE3)* 73(PD4)* 76(PD15)* 77(PD10)* 78(PE2)* 79(PE0)* 80(PD5)* 81(PD6)* 82(PD11)* 83(PC8)* 85(ANT_NC)*

### Notes on the sheet
- (near U6) BLE - STM32WB5MM
- Title
- Size:
- Date:
- A4
- Number:
- Revision:
- Sheet
- of
- SEMILLA3 OÜ
- Seebi tn 1-1501, Tallinn 11316. Estonia.
- Registry No.: 16636757
- VAT No. EE102568505
- File:

### Library data of the parts
C34 C36 = CAP_MLCC_0603: as C9 on sheet SML-230109PCB1__MCU; [01] - MPN Code: *; [02] - Manufacturer: *; [03] - Datasheet: *; [05] - Temperature range: *; [07] - PVP Dealer name: *; [08] - PVP 1K: *; Voltage: 010
C35 = CAP_MLCC_0603: as C25 on sheet SML-230109PCB1__LCD; [01] - MPN Code: *; [02] - Manufacturer: *; [03] - Datasheet: *; [05] - Temperature range: *; [07] - PVP Dealer name: *; [08] - PVP 1K: *; Voltage: 010
U6 = STM32WB5MMGH6TR: MCU/BLE ARM 32bit, M0+ & M4 (64MHz), 1MB/256KB, 6dBm, -96dBm, SIP-LGA-86; [02] - Manufacturer: STMicroelectronics; [04] - Power features: Vin=1'8-3'6V; [05] - Temperature range: -40 to +85 ºC; [00] - Description (BOM): MCU/BLE ARM 32bit, M0+ & M4 (64MHz), 1MB/256KB, 6dBm, -96dBm, SIP-LGA-86; [03] - Datasheet: https://www.st.com/resource/en/datasheet/stm32wb5mmg.pdf; [06] - Package: SIP-LGA-86; [07] - PVP Dealer name: *; [08] - PVP 1K: *; STAR Code: *; [01] - MPN Code: STM32WB5MMGH6TR

## Nets that join several sheets
+3V3: SML-230109PCB1__PWR (C2.2 R1.2 U1.1 U1.2), SML-230109PCB1__MCU (24 pins), SML-230109PCB1__LCD (7 pins)
+3V3(BLE): SML-230109PCB1__PWR (C4.2 U2.5), SML-230109PCB1__MCU (R11.2), SML-230109PCB1__BLE (6 pins)
+3V3(NFC): SML-230109PCB1__PWR (C6.2 U3.5), SML-230109PCB1__NFC (P6.4)
+5V(USB): SML-230109PCB1__PWR (11 pins), SML-230109PCB1__LCD (5 pins)
GND: SML-230109PCB1__PWR (21 pins), SML-230109PCB1__MCU (28 pins), SML-230109PCB1__LCD (20 pins), SML-230109PCB1__NFC (P6.0 P6.5), SML-230109PCB1__BLE (14 pins)
BLE_BOOT: SML-230109PCB1__MCU (U4.23), SML-230109PCB1__BLE (U6.13)
BLE_EN: SML-230109PCB1__PWR (R3.2 U2.3), SML-230109PCB1__MCU (U4.7)
BLE_UART2_RX: SML-230109PCB1__MCU (U4.25), SML-230109PCB1__BLE (U6.1)
BLE_UART2_TX: SML-230109PCB1__MCU (U4.24), SML-230109PCB1__BLE (U6.56)
BLE_WAKEUP: SML-230109PCB1__MCU (U4.28), SML-230109PCB1__BLE (U6.3)
LCD_BACKLIGHT: SML-230109PCB1__MCU (U4.67), SML-230109PCB1__LCD (R14.1 U5.7)
LCD_RESET: SML-230109PCB1__MCU (U4.68), SML-230109PCB1__LCD (P3.8)
LTDC_CLK: SML-230109PCB1__MCU (U4.84), SML-230109PCB1__LCD (P3.38)
LTDC_DE: SML-230109PCB1__MCU (U4.87), SML-230109PCB1__LCD (P3.52)
LTDC_HSYNC: SML-230109PCB1__MCU (U4.97), SML-230109PCB1__LCD (P3.36)
LTDC_VSYNC: SML-230109PCB1__MCU (U4.60), SML-230109PCB1__LCD (P3.37)
NFC_EN: SML-230109PCB1__PWR (R4.2 U3.3), SML-230109PCB1__MCU (U4.80)
NFC_NSS: SML-230109PCB1__MCU (U4.32), SML-230109PCB1__NFC (P6.3)
NFC_USART3_RX: SML-230109PCB1__MCU (U4.29), SML-230109PCB1__NFC (P6.2)
NFC_USART3_TX: SML-230109PCB1__MCU (U4.31), SML-230109PCB1__NFC (P6.1)
TOUCH_I2C1_SCL: SML-230109PCB1__MCU (U4.92), SML-230109PCB1__LCD (P4.3)
TOUCH_I2C1_SDA: SML-230109PCB1__MCU (U4.93), SML-230109PCB1__LCD (P4.5)
TOUCH_INT: SML-230109PCB1__MCU (U4.91), SML-230109PCB1__LCD (P4.9)
TOUCH_RESET: SML-230109PCB1__MCU (U4.90), SML-230109PCB1__LCD (P4.7)

## Assembly variants
VH1.0: not fitted R6 R7 R17 R?